# Altium schematic sheet FOC_Driver.SchDoc
size A3; DocumentNumber: 1; SheetNumber: 1; SheetTotal: 1
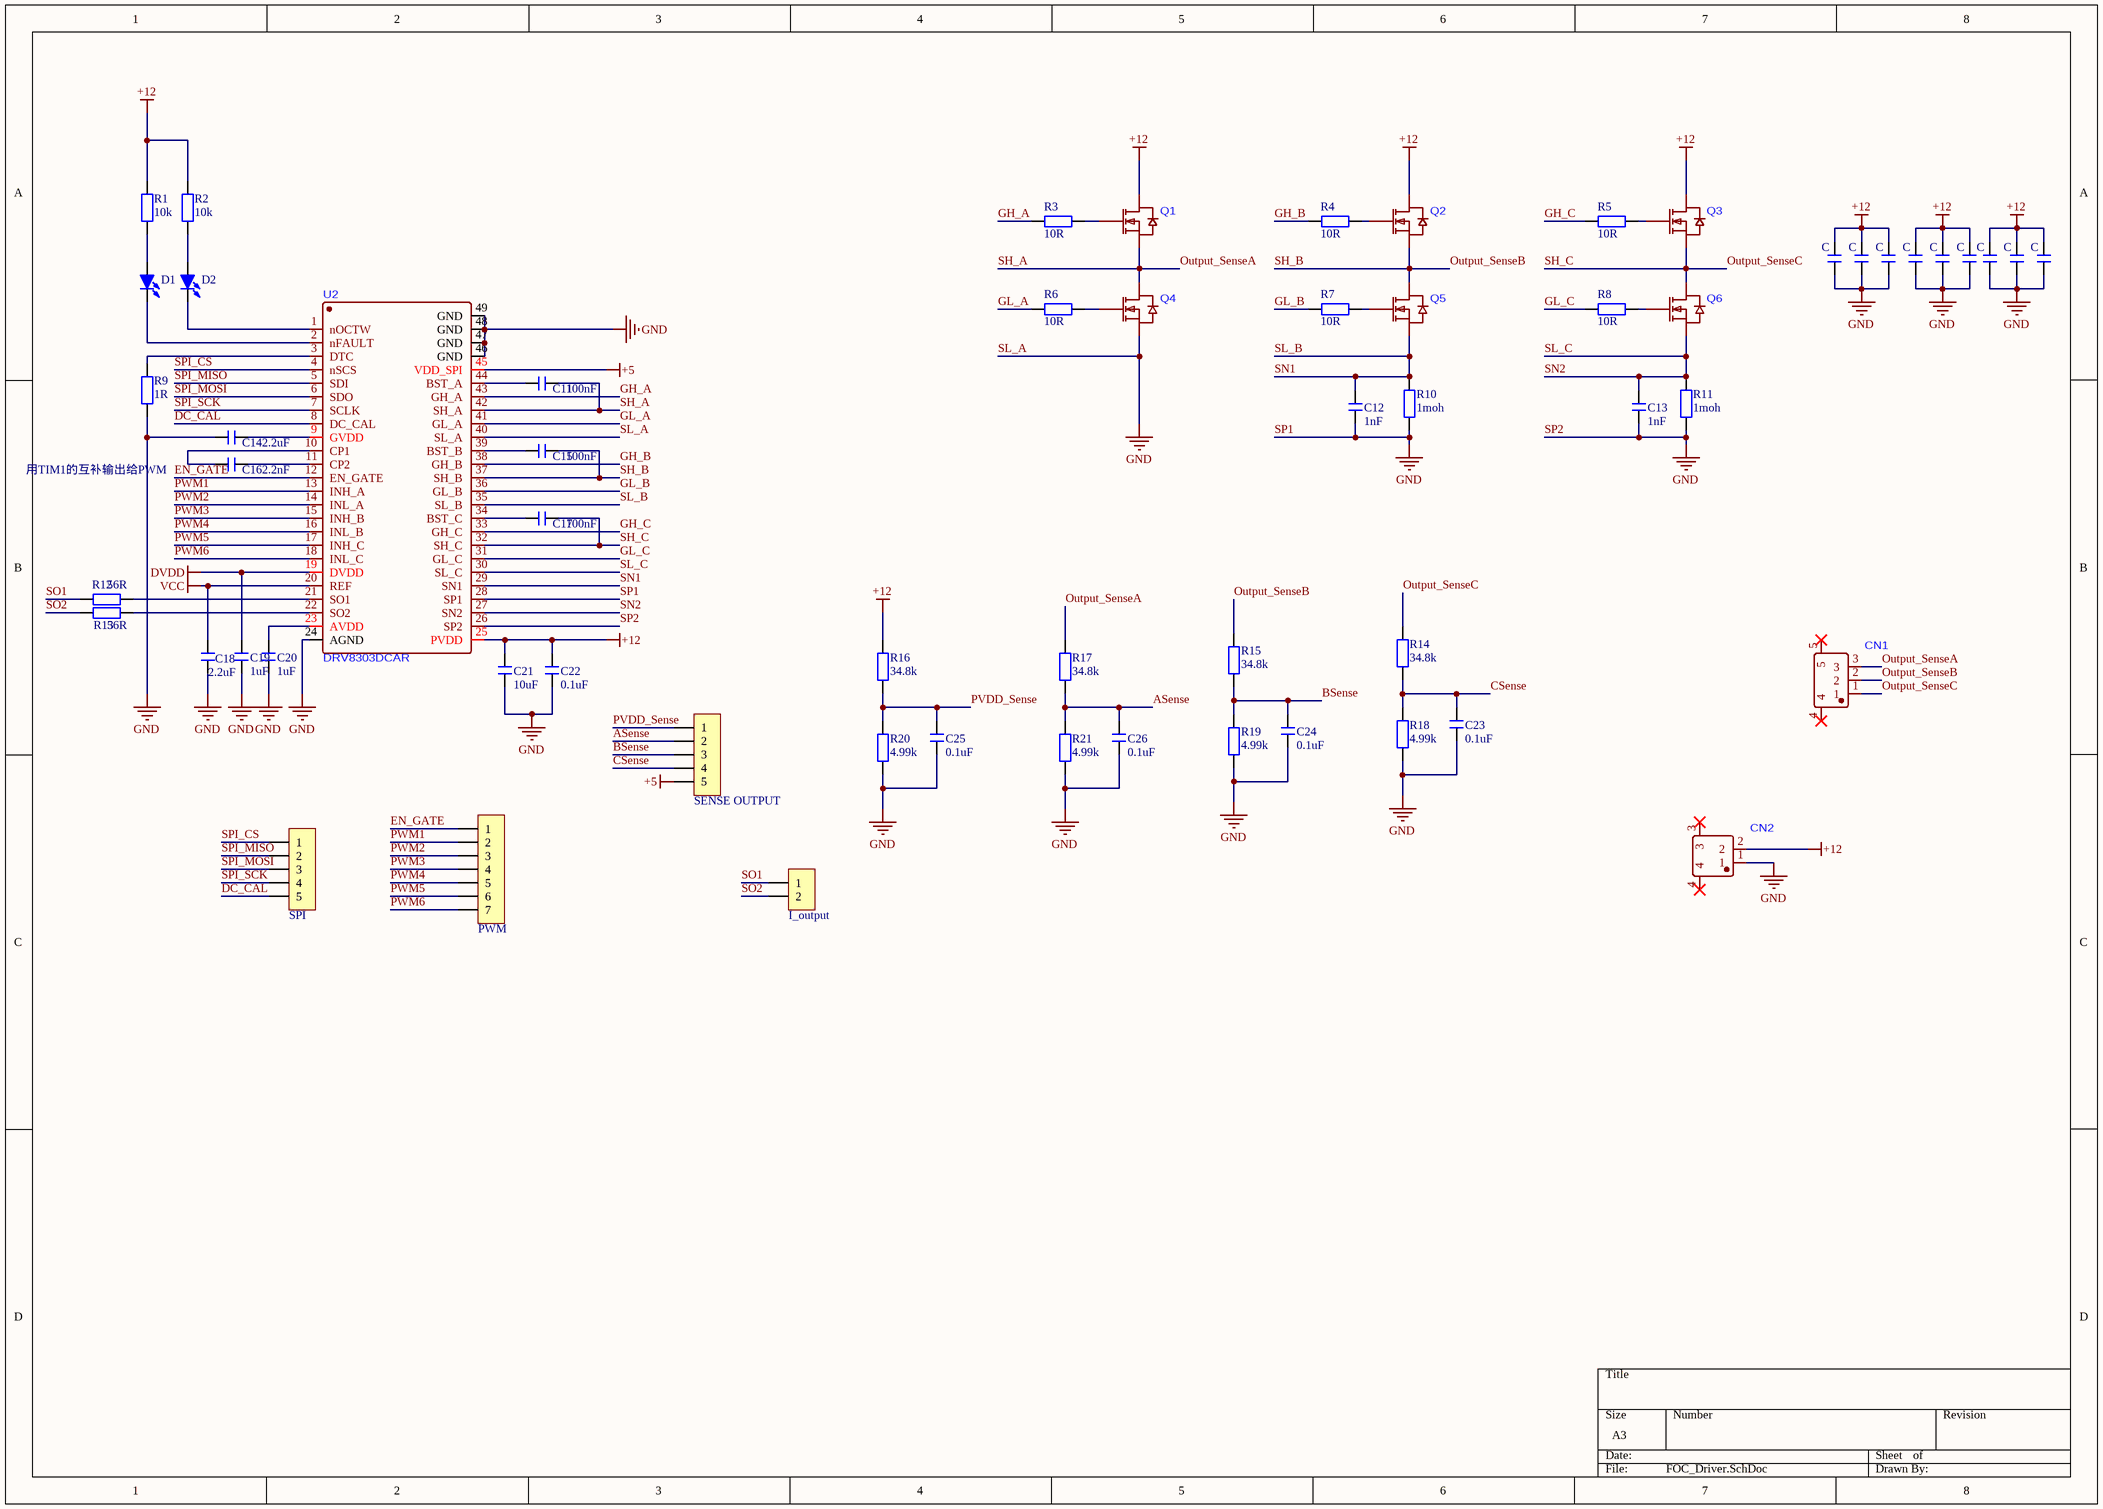
[diagram p0: FOC_Driver.SchDoc]

## Parts
C2  C  [C 0805_M]
C3  C  [C 0805_M]
C4  C  [C 0805_M]
C5  C  [C 0805_M]
C6  C  [C 0805_M]
C7  C  [C 0805_M]
C8  C  [C 0805_M]
C9  C  [C 0805_M]
C10  C  [C 0805_M]
C11  100nF  [C 0603_M]
C12  1nF  [C 0603_M]
C13  1nF  [C 0603_M]
C14  2.2uF  [C 0603_M]
C15  100nF  [C 0603_M]
C16  2.2nF  [C 0603_M]
C17  100nF  [C 0603_M]
C18  2.2uF  [C 0603_M]
C19  1uF  [C 0603_M]
C20  1uF  [C 0603_M]
C21  10uF  [C 0603_M]
C22  0.1uF  [C 0603_M]
C23  0.1uF  [C 0603_M]
C24  0.1uF  [C 0603_M]
C25  0.1uF  [C 0603_M]
C26  0.1uF  [C 0603_M]
CN1  MR30PW-F  [CONN-TH_MR30PW-F]  (value not drawn)
CN2  XT30PW-M  [CONN-TH_XT30PW-M]  (value not drawn)
D1  LED-SMD  [LED 0603G]  (value not drawn)
D2  LED-SMD  [LED 0603G]  (value not drawn)
I_output  HDR-1X2  [HDR2.54-LI-2P]  (value not drawn)
PWM  HDR-1X7  [HDR2.54-LI-7P]  (value not drawn)
Q1  IRLR7843TRPBF  [TO-252-2_L6.5-W6.1-P4.58-LS10.0-TR]  (value not drawn)
Q2  IRLR7843TRPBF  [TO-252-2_L6.5-W6.1-P4.58-LS10.0-TR]  (value not drawn)
Q3  IRLR7843TRPBF  [TO-252-2_L6.5-W6.1-P4.58-LS10.0-TR]  (value not drawn)
Q4  IRLR7843TRPBF  [TO-252-2_L6.5-W6.1-P4.58-LS10.0-TR]  (value not drawn)
Q5  IRLR7843TRPBF  [TO-252-2_L6.5-W6.1-P4.58-LS10.0-TR]  (value not drawn)
Q6  IRLR7843TRPBF  [TO-252-2_L6.5-W6.1-P4.58-LS10.0-TR]  (value not drawn)
R1  value 10k  [R 0603_M]  (hidden comment: R)
R2  value 10k  [R 0603_M]  (hidden comment: R)
R3  value 10R  [R 0603_M]  (hidden comment: R)
R4  value 10R  [R 0603_M]  (hidden comment: R)
R5  value 10R  [R 0603_M]  (hidden comment: R)
R6  value 10R  [R 0603_M]  (hidden comment: R)
R7  value 10R  [R 0603_M]  (hidden comment: R)
R8  value 10R  [R 0603_M]  (hidden comment: R)
R9  value 1R  [R 0603_M]  (hidden comment: R)
R10  value 1moh  [R 1206_M]  (hidden comment: R)
R11  value 1moh  [R 1206_M]  (hidden comment: R)
R12  value 56R  [R 0603_M]  (hidden comment: R)
R13  value 56R  [R 0603_M]  (hidden comment: R)
R14  value 34.8k  [R 0603_M]  (hidden comment: R)
R15  value 34.8k  [R 0603_M]  (hidden comment: R)
R16  value 34.8k  [R 0603_M]  (hidden comment: R)
R17  value 34.8k  [R 0603_M]  (hidden comment: R)
R18  value 4.99k  [R 0603_M]  (hidden comment: R)
R19  value 4.99k  [R 0603_M]  (hidden comment: R)
R20  value 4.99k  [R 0603_M]  (hidden comment: R)
R21  value 4.99k  [R 0603_M]  (hidden comment: R)
SENSE_OUTPUT  HDR-1X5  [HDR2.54-LI-5P]  (value not drawn)
SPI  HDR-1X5  [HDR2.54-LI-5P]  (value not drawn)
U2  DRV8303DCAR  [HTSSOP-48_L12.5-W6.1-P0.50-LS8.1-BL-EP]

## Nets
+5: SENSE_OUTPUT.5 U2.45(VDD_SPI)
+12: C2.2 C3.2 C4.2 C5.2 C6.2 C7.2 C8.2 C9.2 C10.2 C21.2 C22.2 CN2.2 Q1.4(D) Q2.4(D) Q3.4(D) R1.2 R2.2 R16.2 U2.25(PVDD)
DVDD: C19.2 U2.19(DVDD)
SL_A: C2.1 C3.1 C4.1 C5.1 C6.1 C7.1 C8.1 C9.1 C10.1 C12.1 C13.1 C14.1 C18.1 C19.1 C20.1 C21.1 C22.1 C23.1 C24.1 C25.1 C26.1 CN2.1 Q4.3(S) R9.1 R10.1 R11.1 R18.1 R19.1 R20.1 R21.1 U2.24(AGND) U2.26(SP2) U2.28(SP1) U2.40(SL_A) U2.46(GND) U2.47(GND) U2.48(GND) U2.49(GND)  [also labelled GND, SP1, SP2]
VCC: C18.2 U2.20(REF)
ASense: C26.2 R17.1 R21.2 SENSE_OUTPUT.2
BSense: C24.2 R15.1 R19.2 SENSE_OUTPUT.3
CSense: C23.2 R14.1 R18.2 SENSE_OUTPUT.4
DC_CAL: SPI.5 U2.8(DC_CAL)
EN_GATE: PWM.1 U2.12(EN_GATE)
GH_A: R3.2 U2.43(GH_A)
GH_B: R4.2 U2.38(GH_B)
GH_C: R5.2 U2.33(GH_C)
GL_A: R6.2 U2.41(GL_A)
GL_B: R7.2 U2.36(GL_B)
GL_C: R8.2 U2.31(GL_C)
Output_SenseA: C11.2 CN1.3 Q1.3(S) Q4.4(D) R17.2 U2.42(SH_A)  [also labelled SH_A]
Output_SenseB: C15.2 CN1.2 Q2.3(S) Q5.4(D) R15.2 U2.37(SH_B)  [also labelled SH_B]
Output_SenseC: C17.2 CN1.1 Q3.3(S) Q6.4(D) R14.2 U2.32(SH_C)  [also labelled SH_C]
PVDD_Sense: C25.2 R16.1 R20.2 SENSE_OUTPUT.1
PWM1: PWM.2 U2.13(INH_A)
PWM2: PWM.3 U2.14(INL_A)
PWM3: PWM.4 U2.15(INH_B)
PWM4: PWM.5 U2.16(INL_B)
PWM5: PWM.6 U2.17(INH_C)
PWM6: PWM.7 U2.18(INL_C)
SL_B: C12.2 Q5.3(S) R10.2 U2.29(SN1) U2.35(SL_B)  [also labelled SN1]
SL_C: C13.2 Q6.3(S) R11.2 U2.27(SN2) U2.30(SL_C)  [also labelled SN2]
SO1: I_output.1 R12.2
SO2: I_output.2 R13.2
SPI_CS: SPI.1 U2.4(nSCS)
SPI_MISO: SPI.2 U2.5(SDI)
SPI_MOSI: SPI.3 U2.6(SDO)
SPI_SCK: SPI.4 U2.7(SCLK)
NetC11_1: C11.1 U2.44(BST_A)
NetC14_2: C14.2 U2.9(GVDD)
NetC15_1: C15.1 U2.39(BST_B)
NetC16_1: C16.1 U2.10(CP1)
NetC16_2: C16.2 U2.11(CP2)
NetC17_1: C17.1 U2.34(BST_C)
NetC20_2: C20.2 U2.23(AVDD)
NetD1_1: D1.1(A) R1.1
NetD1_2: D1.2(K) U2.2(nFAULT)
NetD2_1: D2.1(A) R2.1
NetD2_2: D2.2(K) U2.1(nOCTW)
NetQ1_1: Q1.1(G) R3.1
NetQ2_1: Q2.1(G) R4.1
NetQ3_1: Q3.1(G) R5.1
NetQ4_1: Q4.1(G) R6.1
NetQ5_1: Q5.1(G) R7.1
NetQ6_1: Q6.1(G) R8.1
NetR9_2: R9.2 U2.3(DTC)
NetR12_1: R12.1 U2.21(SO1)
NetR13_1: R13.1 U2.22(SO2)

Not connected (* = marked no-connect by the designer): CN1 4* 5*; CN2 3* 4*

## Notes on the sheet
- 用TIM1的互补输出给PWM

## Library data of the parts
C2-C10 = C: 无极性贴片电容; 版权归属: 电协硬件组; value: 10uF
C11-C26 = C: 无极性贴片电容; 版权归属: 电协硬件组
D1 D2 = LED-SMD: 贴片LED; 版权归属: 电协硬件组
I_output = Header 2: 2P接插件; 版权归属: 源创客; BOM名称: 2P接插件; 学习资源: www.ooocke.com
PWM = Header 7: 7P接插件; 版权归属: 源创客; BOM名称: 7P接插件; 学习资源: www.ooocke.com
R1-R21 = R: 贴片电阻; 版权归属: 电协硬件组
SENSE_OUTPUT SPI = Header 5: 5P接插件; 版权归属: 源创客; BOM名称: 5P接插件; 学习资源: www.ooocke.com